# Altium schematic sheet Relay.SchDoc: RELAY
size 420 x 297 mm; DrawnBy: Hung Vo; SheetNumber: 4; SheetTotal: 6; MasterProject: BTL TKHTN
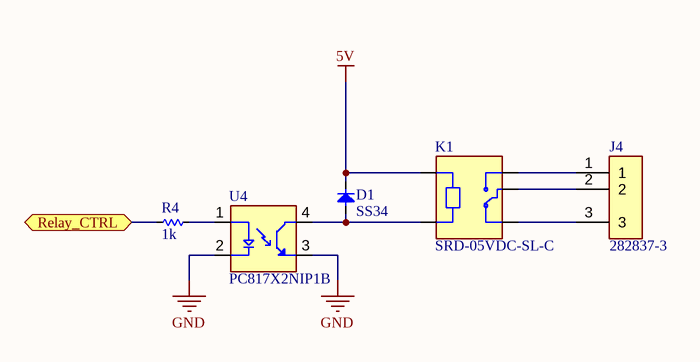
[diagram p0: Relay.SchDoc]

## Parts
D1  SS34  [DO-214AC_SMA]
J4  282837-3  [TE_282837-3]
K1  SRD-05VDC-SL-C  [RELAY_SRD-05VDC-SL-C]
R4  1k  [RES_C_1608X60]
U4  PC817X2NIP1B  [SOIC254P960X420-4N]

## Ports
Relay_CTRL (bidir, see MCU[1C])

## Nets
5V: D1.1(K) K1.A1
GND: U4.2(C) U4.3(ET)
Relay_CTRL: R4.1 ; port Relay_CTRL
NetD1_2: D1.2(A) K1.A2 U4.4(CT)
NetJ4_1: J4.1 K1.NO
NetJ4_2: J4.2 K1.COM
NetJ4_3: J4.3 K1.NC
NetR4_2: R4.2 U4.1(A)

## Notes on the sheet
- Sub-system:
- Project:
- Design by:
- Sheet title:
- Sheet
- of
- Checked by:
- Approved by:
- Doc No:
- Revision:
- Size:
- Date:
- A3

## Library data of the parts
D1 = Diode SMD: Default Diode; Code - JEDEC: DO-214-AB; Value: 1N5007; Published: 8-Jun-2000; Revision: July-2002: Re-released for DXP Platform.; Publisher: Altium Limited
J4 = 282837-3: TERMI-BLOK PCB MOUNT 3P; Availability: Unavailable; Package: None; MP: 282837-3; Value: *; Price: None
K1 = SRD-05VDC-SL-C: 5V Trigger Relay Module For Arduino And Raspberry Pi 5V Trigger Relay Module For Arduino And Raspberry Pi; MF: Songle Relay; Check_prices: https://www.snapeda.com/parts/SRD-05VDC-SL-C/Songle+Relay/view-part/?ref=eda; Value: *; Availability: Not in stock; Price: None; Package: NON STANDARD-5 Songle Relay; MP: SRD-05VDC-SL-C; SnapEDA_Link: https://www.snapeda.com/parts/SRD-05VDC-SL-C/Songle+Relay/view-part/?ref=snap
R4 = RES_SMD: RES
U4 = PC817X2NIP1B: Optocoupler DC-IN 1-CH Transistor DC-OUT 4-Pin DIP SMD T/R; MF: Sharp Microelectronics; SnapEDA_Link: https://www.snapeda.com/parts/PC817X2NIP1B/Sharp+Microelectronics/view-part/?ref=snap; Package: SMD-4 Sharp Microelectronics; Value: *; MP: PC817X2NIP1B; Check_prices: https://www.snapeda.com/parts/PC817X2NIP1B/Sharp+Microelectronics/view-part/?ref=eda